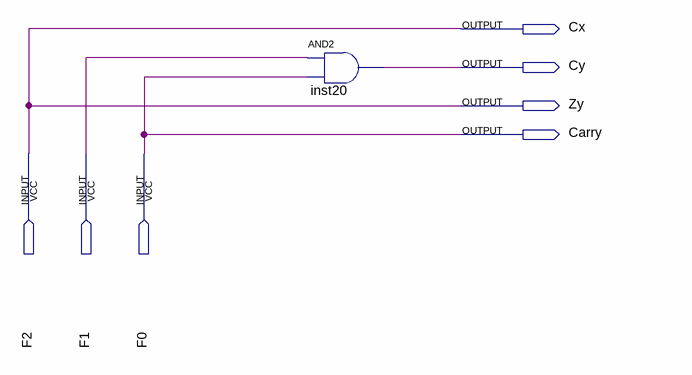
[diagram p0: schematic sheet]
// Quartus schematic Decodificador.bdf as structural Verilog: 1 symbols, 7 pins
module Decodificador (
  input  F2,
  input  F1,
  input  F0,
  output Cx,
  output Cy,
  output Zy,
  output Carry
);

  and inst20 (Cy, F1, F0);

  assign Carry = F0;
  assign Cx = F2;
  assign Zy = F2;
endmodule
